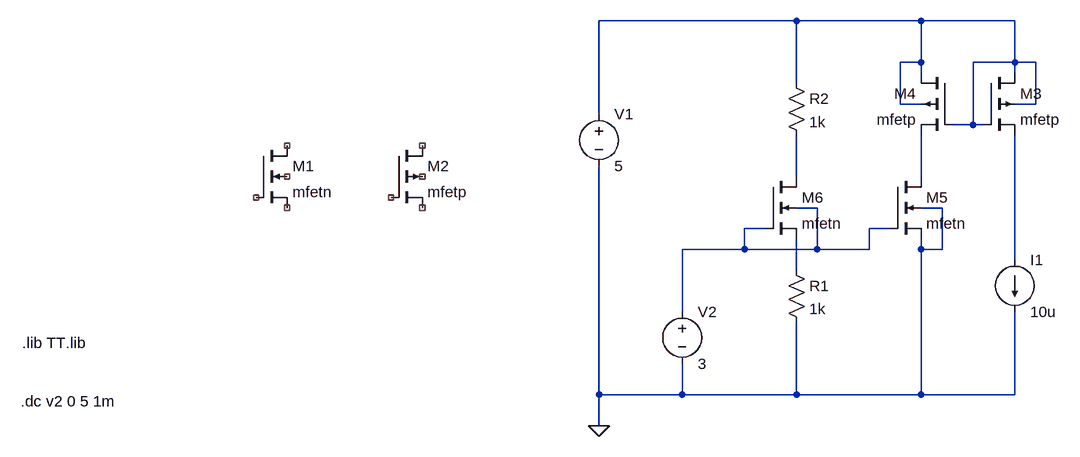
[diagram p0: schematic Draft1.asc]
Draft1.asc, the LTspice schematic file:
Version 4
SHEET 1 1252 680
WIRE 832 -80 528 -80
WIRE 1024 -80 832 -80
WIRE 1168 -80 1024 -80
WIRE 1024 -16 1024 -80
WIRE 1024 -16 992 -16
WIRE 1168 -16 1168 -80
WIRE 1168 -16 1104 -16
WIRE 1200 -16 1168 -16
WIRE 1024 0 1024 -16
WIRE 1168 0 1168 -16
WIRE 832 16 832 -80
WIRE 992 48 992 -16
WIRE 1024 48 992 48
WIRE 1200 48 1200 -16
WIRE 1200 48 1168 48
WIRE 528 64 528 -80
WIRE 1104 80 1104 -16
WIRE 1104 80 1072 80
WIRE 1120 80 1104 80
WIRE 832 160 832 96
WIRE 1024 160 1024 96
WIRE 864 208 832 208
WIRE 1056 208 1024 208
WIRE 784 240 752 240
WIRE 976 240 944 240
WIRE 752 272 752 240
WIRE 752 272 656 272
WIRE 864 272 864 208
WIRE 864 272 752 272
WIRE 944 272 944 240
WIRE 944 272 864 272
WIRE 1024 272 1024 256
WIRE 1056 272 1056 208
WIRE 1056 272 1024 272
WIRE 1168 288 1168 96
WIRE 832 304 832 256
WIRE 656 368 656 272
WIRE 528 496 528 144
WIRE 656 496 656 448
WIRE 656 496 528 496
WIRE 832 496 832 384
WIRE 832 496 656 496
WIRE 1024 496 1024 272
WIRE 1024 496 832 496
WIRE 1168 496 1168 368
WIRE 1168 496 1024 496
WIRE 528 544 528 496
FLAG 528 544 0
SYMBOL nmos4 0 112 R0
SYMATTR InstName M1
SYMATTR Value mfetn
SYMBOL pmos4 208 112 R0
SYMATTR InstName M2
SYMATTR Value mfetp
SYMBOL voltage 528 48 R0
WINDOW 123 0 0 Left 0
WINDOW 39 0 0 Left 0
SYMATTR InstName V1
SYMATTR Value 5
SYMBOL voltage 656 352 R0
WINDOW 123 0 0 Left 0
WINDOW 39 0 0 Left 0
SYMATTR InstName V2
SYMATTR Value 3
SYMBOL pmos4 1120 0 R0
SYMATTR InstName M3
SYMATTR Value mfetp
SYMATTR Value2 l=1.8u w=1.2u
SYMBOL pmos4 1072 0 M0
SYMATTR InstName M4
SYMATTR Value mfetp
SYMATTR Value2 l=1.8u w=1.2u
SYMBOL nmos4 976 160 R0
SYMATTR InstName M5
SYMATTR Value mfetn
SYMATTR Value2 l=0.6u w=1.2u
SYMBOL current 1168 288 R0
WINDOW 123 0 0 Left 0
WINDOW 39 0 0 Left 0
SYMATTR InstName I1
SYMATTR Value 10u
SYMBOL res 816 288 R0
SYMATTR InstName R1
SYMATTR Value 1k
SYMBOL nmos4 784 160 R0
SYMATTR InstName M6
SYMATTR Value mfetn
SYMATTR Value2 l=0.6u w=1.2u
SYMBOL res 816 0 R0
SYMATTR InstName R2
SYMATTR Value 1k
TEXT -360 416 Left 2 !.lib TT.lib
TEXT -362 506 Left 2 !.dc v2 0 5 1m

The netlist it stands for:
* Draft1.asc
M1 NC_01 NC_02 NC_03 NC_04 mfetn
M2 NC_05 NC_06 NC_07 NC_08 mfetp
V1 N001 0 5
V2 N004 0 3
M3 N001 N001 N005 N001 mfetp l=1.8u w=1.2u
M4 N001 N001 N003 N001 mfetp l=1.8u w=1.2u
M5 N003 N004 0 0 mfetn l=0.6u w=1.2u
I1 N005 0 10u
R1 N006 0 1k
M6 N002 N004 N006 N004 mfetn l=0.6u w=1.2u
R2 N001 N002 1k
.model NMOS NMOS
.model PMOS PMOS
.lib standard.mos
.lib TT.lib
.dc v2 0 5 1m
.backanno
.end